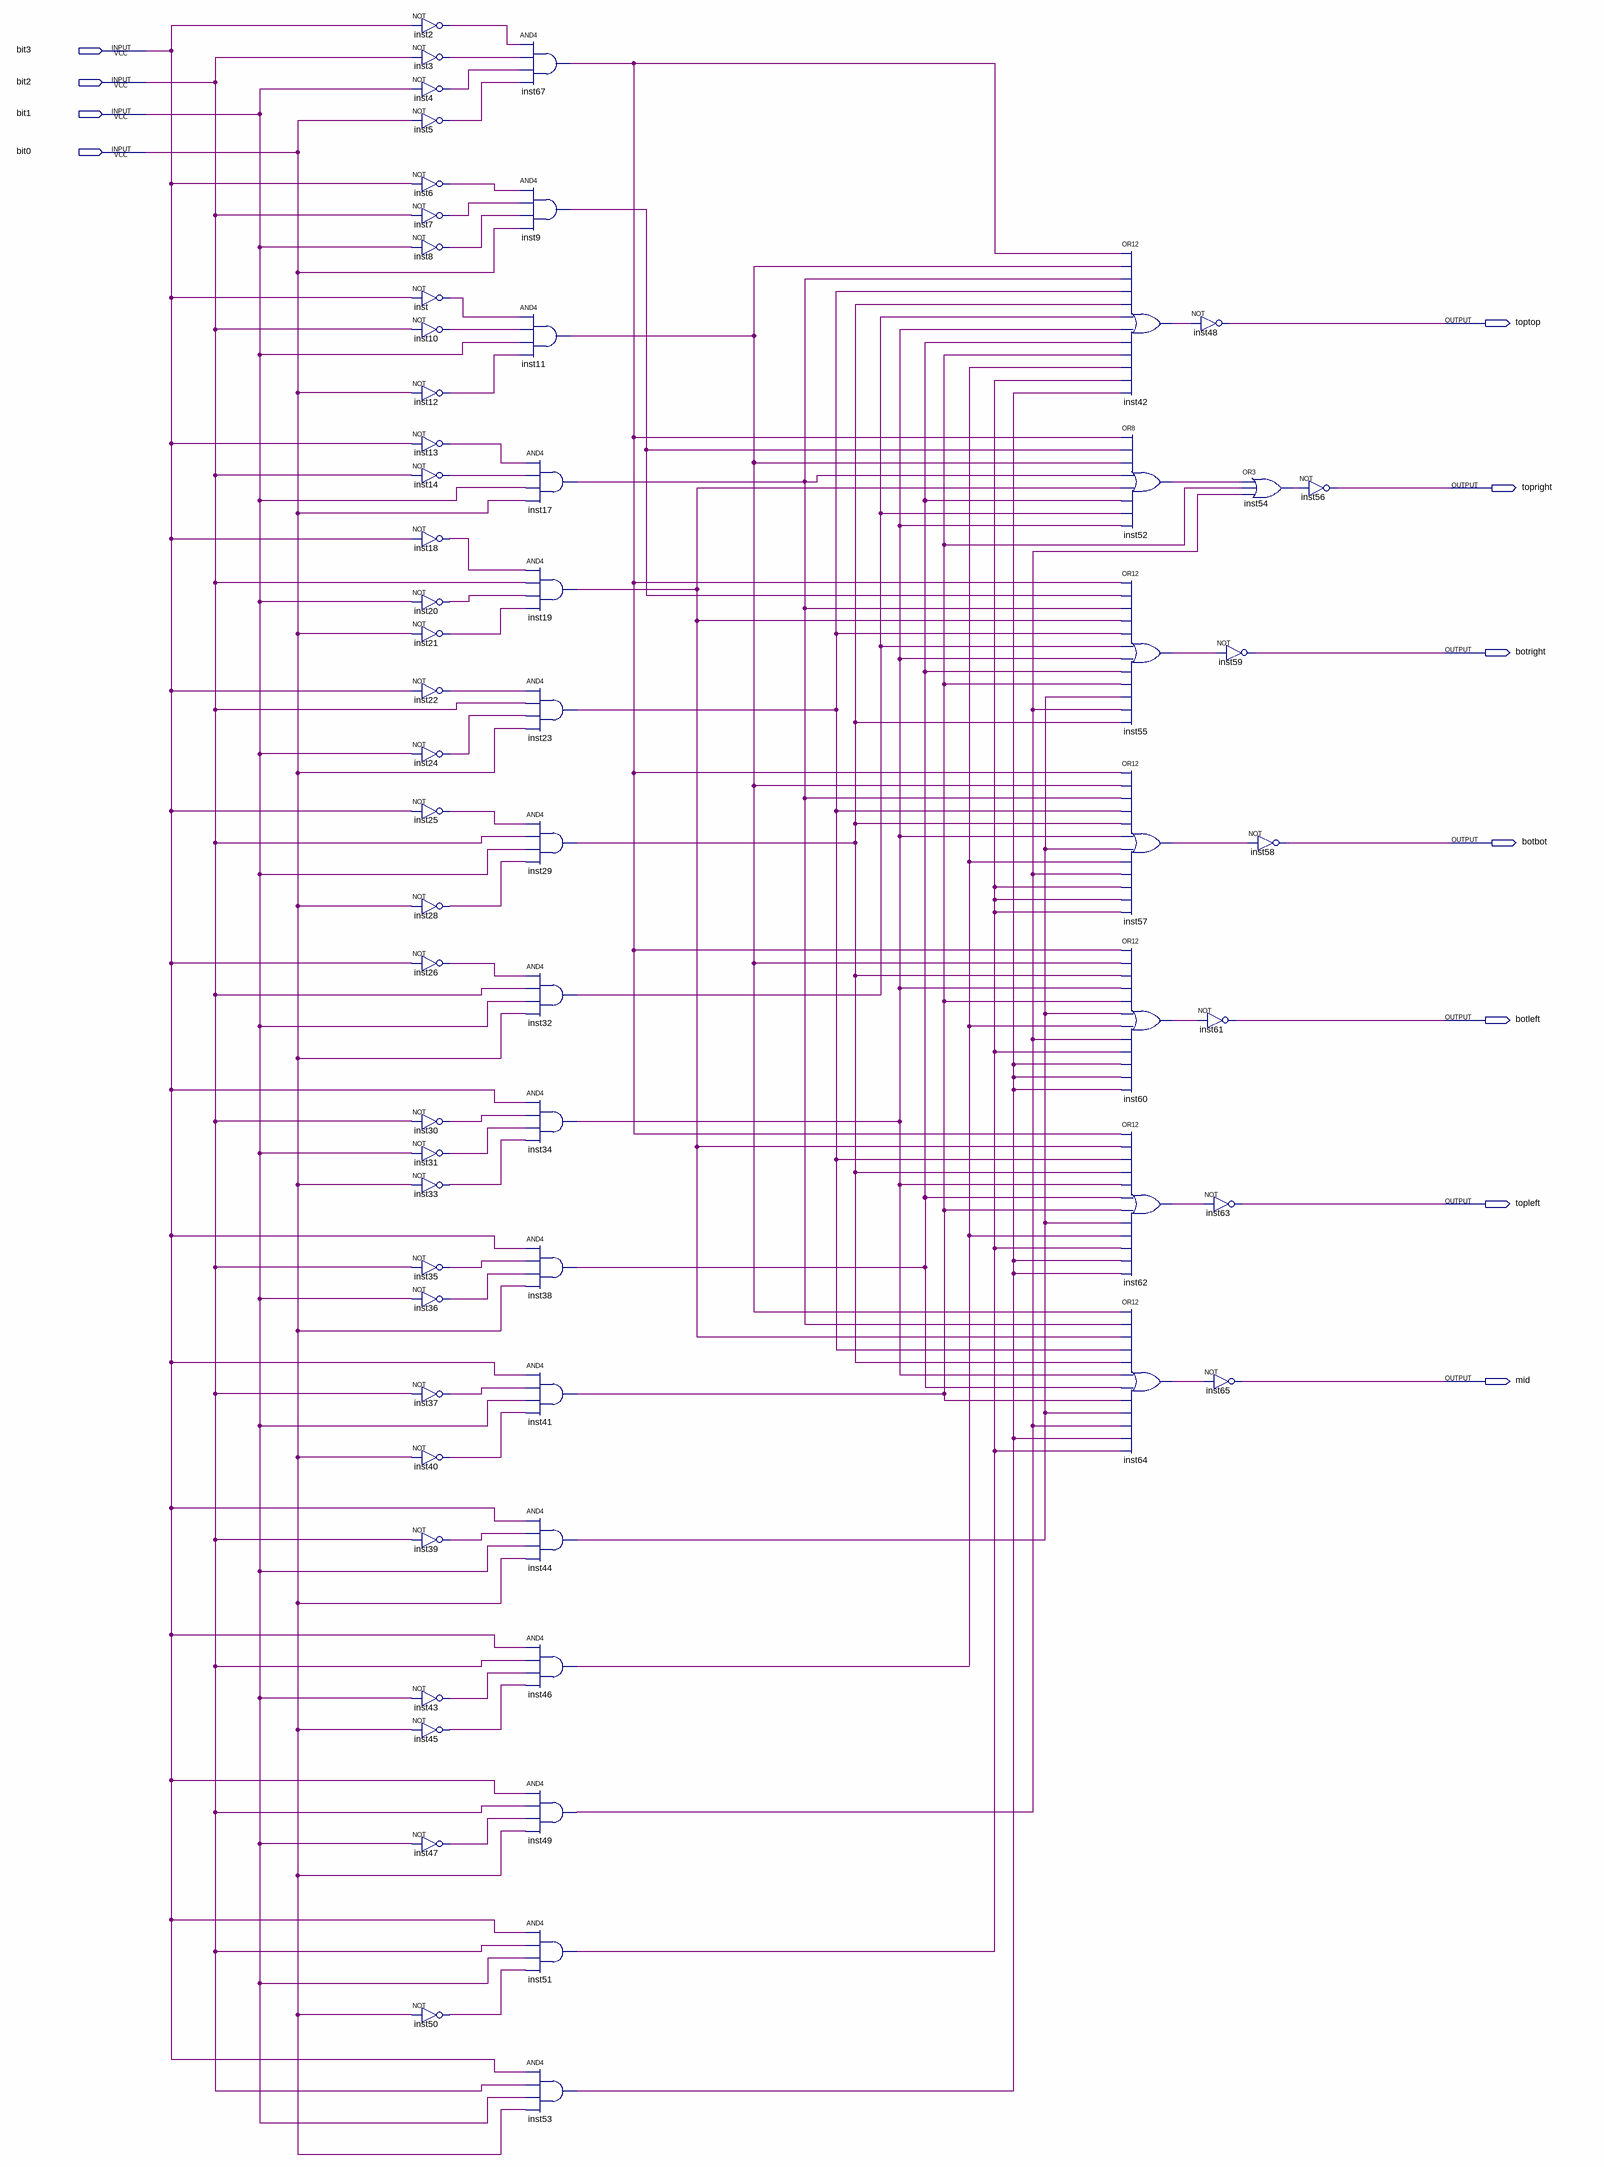
[diagram p0: schematic sheet]
// Quartus schematic aula04.bdf as structural Verilog: 63 symbols, 11 pins
module aula04 (
  input  bit3,
  input  bit2,
  input  bit1,
  input  bit0,
  output toptop,
  output topright,
  output botright,
  output botbot,
  output botleft,
  output topleft,
  output mid
);

  wire inst2_out, inst3_out, inst4_out, inst5_out, inst6_out, inst7_out, inst8_out, inst9_out, inst10_out,
       inst11_out, inst12_out, inst13_out, inst14_out, inst17_out, inst18_out, inst19_out, inst20_out,
       inst21_out, inst22_out, inst23_out, inst24_out, inst25_out, inst26_out, inst28_out, inst29_out,
       inst30_out, inst31_out, inst32_out, inst33_out, inst34_out, inst35_out, inst36_out, inst37_out,
       inst38_out, inst39_out, inst40_out, inst41_out, inst42_out, inst43_out, inst44_out, inst45_out,
       inst46_out, inst47_out, inst49_out, inst50_out, inst51_out, inst52_out, inst53_out, inst54_out,
       inst55_out, inst57_out, inst60_out, inst62_out, inst64_out, inst67_out, inst_out;

  not inst2 (inst2_out, bit3);
  not inst3 (inst3_out, bit2);
  not inst4 (inst4_out, bit1);
  not inst5 (inst5_out, bit0);
  not inst6 (inst6_out, bit3);
  not inst7 (inst7_out, bit2);
  not inst8 (inst8_out, bit1);
  not inst (inst_out, bit3);
  not inst10 (inst10_out, bit2);
  not inst12 (inst12_out, bit0);
  not inst13 (inst13_out, bit3);
  not inst14 (inst14_out, bit2);
  not inst18 (inst18_out, bit3);
  not inst20 (inst20_out, bit1);
  not inst21 (inst21_out, bit0);
  not inst22 (inst22_out, bit3);
  not inst24 (inst24_out, bit1);
  not inst25 (inst25_out, bit3);
  not inst28 (inst28_out, bit0);
  not inst26 (inst26_out, bit3);
  not inst30 (inst30_out, bit2);
  not inst31 (inst31_out, bit1);
  not inst33 (inst33_out, bit0);
  not inst35 (inst35_out, bit2);
  not inst36 (inst36_out, bit1);
  not inst37 (inst37_out, bit2);
  not inst40 (inst40_out, bit0);
  not inst39 (inst39_out, bit2);
  not inst43 (inst43_out, bit1);
  not inst45 (inst45_out, bit0);
  not inst47 (inst47_out, bit1);
  not inst50 (inst50_out, bit0);
  and inst67 (inst67_out, inst2_out, inst3_out, inst4_out, inst5_out);
  and inst9 (inst9_out, inst6_out, inst7_out, inst8_out, bit0);
  and inst11 (inst11_out, inst_out, inst10_out, bit1, inst12_out);
  and inst17 (inst17_out, inst13_out, inst14_out, bit1, bit0);
  and inst19 (inst19_out, inst18_out, bit2, inst20_out, inst21_out);
  and inst23 (inst23_out, inst22_out, bit2, inst24_out, bit0);
  and inst29 (inst29_out, inst25_out, bit2, bit1, inst28_out);
  and inst32 (inst32_out, inst26_out, bit2, bit1, bit0);
  and inst34 (inst34_out, bit3, inst30_out, inst31_out, inst33_out);
  and inst38 (inst38_out, bit3, inst35_out, inst36_out, bit0);
  and inst41 (inst41_out, bit3, inst37_out, bit1, inst40_out);
  and inst44 (inst44_out, bit3, inst39_out, bit1, bit0);
  and inst46 (inst46_out, bit3, bit2, inst43_out, inst45_out);
  and inst49 (inst49_out, bit3, bit2, inst47_out, bit0);
  and inst51 (inst51_out, bit3, bit2, bit1, inst50_out);
  and inst53 (inst53_out, bit3, bit2, bit1, bit0);
  or inst42 (inst42_out, inst67_out, inst11_out, inst17_out, inst23_out, inst29_out, inst32_out, inst34_out, inst38_out, inst41_out, inst46_out, inst51_out, inst53_out);
  or inst52 (inst52_out, inst67_out, inst9_out, inst11_out, inst17_out, inst19_out, inst38_out, inst32_out, inst34_out);
  or inst55 (inst55_out, inst67_out, inst9_out, inst17_out, inst19_out, inst23_out, inst32_out, inst34_out, inst38_out, inst41_out, inst44_out, inst49_out, inst29_out);
  or inst57 (inst57_out, inst67_out, inst11_out, inst17_out, inst23_out, inst29_out, inst34_out, inst44_out, inst46_out, inst49_out, inst51_out, inst51_out, inst51_out);
  or inst60 (inst60_out, inst67_out, inst11_out, inst29_out, inst34_out, inst41_out, inst44_out, inst46_out, inst49_out, inst51_out, inst53_out, inst53_out, inst53_out);
  or inst62 (inst62_out, inst67_out, inst19_out, inst23_out, inst29_out, inst34_out, inst38_out, inst41_out, inst44_out, inst46_out, inst51_out, inst53_out, inst53_out);
  or inst64 (inst64_out, inst11_out, inst17_out, inst19_out, inst23_out, inst29_out, inst34_out, inst38_out, inst41_out, inst44_out, inst49_out, inst53_out, inst51_out);
  not inst48 (toptop, inst42_out);
  not inst61 (botleft, inst60_out);
  not inst63 (topleft, inst62_out);
  not inst65 (mid, inst64_out);
  or inst54 (inst54_out, inst52_out, inst41_out, inst49_out);
  not inst59 (botright, inst55_out);
  not inst58 (botbot, inst57_out);
  not inst56 (topright, inst54_out);
endmodule
